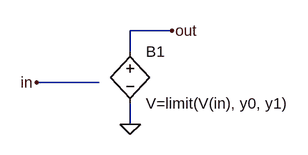
[diagram p0: schematic limit.asc]
limit.asc, the LTspice schematic file:
Version 4
SHEET 1 880 680
WIRE 400 48 336 48
WIRE 336 80 336 48
WIRE 288 128 192 128
WIRE 336 192 336 160
FLAG 192 128 in
FLAG 400 48 out
FLAG 336 192 0
SYMBOL bv 336 64 R0
SYMATTR InstName B1
SYMATTR Value V=limit(V(in), y0, y1)

The netlist it stands for:
* limit.asc
B1 out 0 V=limit(V(in), y0, y1)
.backanno
.end